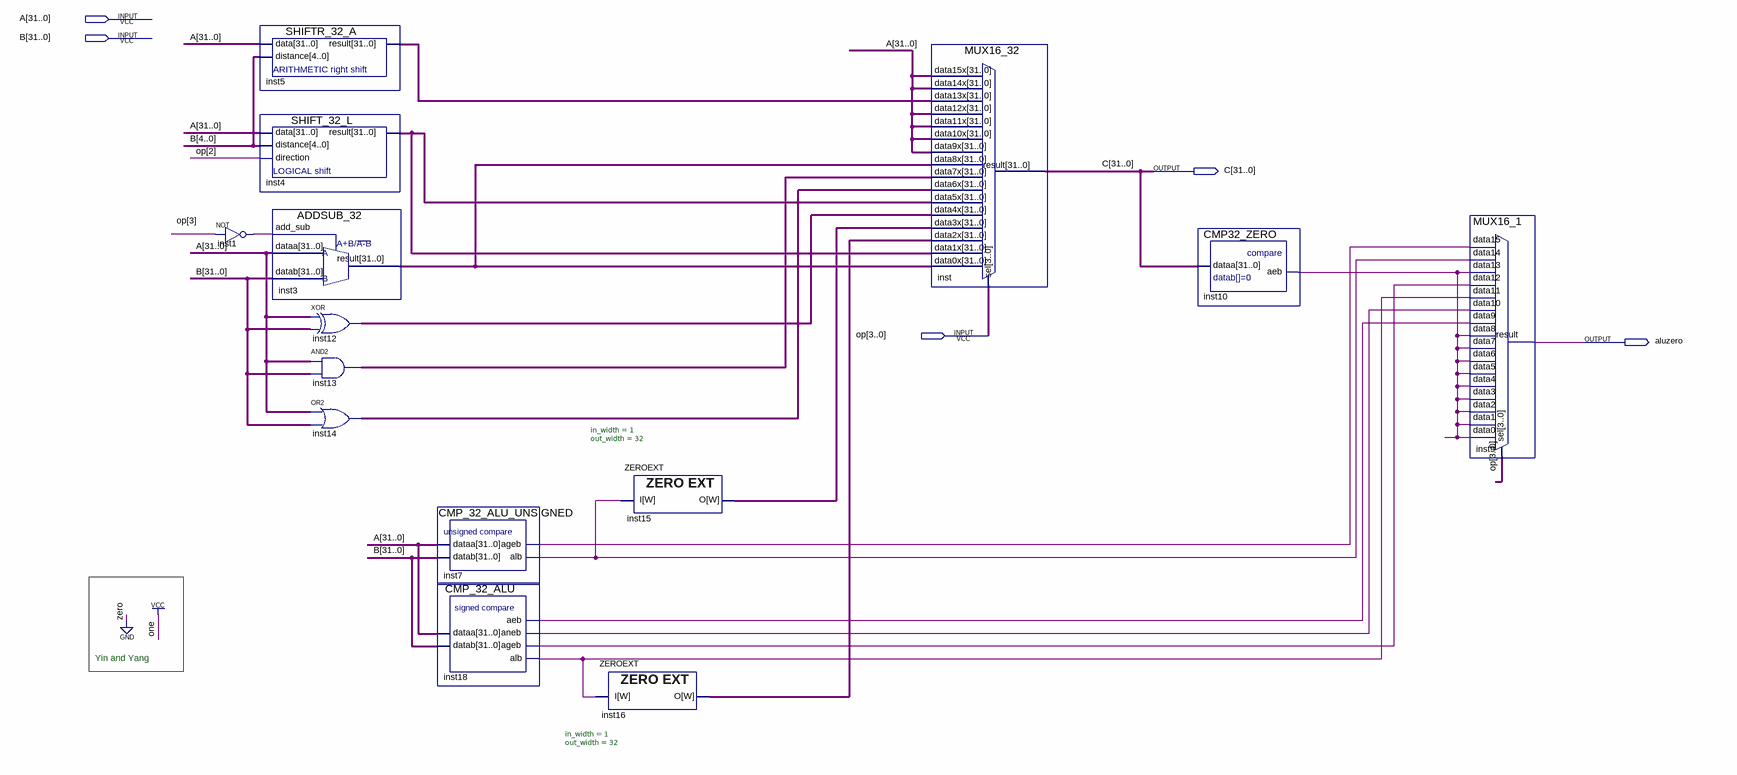
[diagram p0: schematic sheet]
// Quartus schematic ALU.bdf as structural Verilog: 14 symbols, 5 pins
module ALU (
  input  [31:0] A,
  input  [31:0] B,
  input  [3:0] op,
  output [31:0] C,
  output aluzero
);

  wire inst1_out, inst7_ageb, inst7_alb, inst10_aeb, inst18_aeb, inst18_ageb, inst18_alb, inst18_aneb;
  wire [31:0] inst3_result, inst4_result, inst5_result, inst12_out, inst13_out, inst14_out, inst15_o,
       inst16_o;

  not inst1 (inst1_out, op[3]);
  SHIFTR_32_A inst5 (.data(A), .distance(B[4:0]), .result(inst5_result));
  SHIFT_32_L inst4 (.data(A), .distance(B[4:0]), .direction(op[2]), .result(inst4_result));
  ADDSUB_32 inst3 (.add_sub(inst1_out), .dataa(A), .datab(B), .result(inst3_result));
  assign inst12_out = A ^ B;  // XOR inst12, 32 bits wide
  assign inst13_out = A & B;  // AND2 inst13, 32 bits wide
  assign inst14_out = A | B;  // OR2 inst14, 32 bits wide
  CMP_32_ALU_UNSIGNED inst7 (.dataa(A), .datab(B), .ageb(inst7_ageb), .alb(inst7_alb));
  CMP_32_ALU inst18 (.dataa(A), .datab(B), .aeb(inst18_aeb), .aneb(inst18_aneb), .ageb(inst18_ageb), .alb(inst18_alb));
  ZEROEXT #(.in_width(1), .out_width(32)) inst16 (.I(inst18_alb), .O(inst16_o));
  ZEROEXT #(.in_width(1), .out_width(32)) inst15 (.I(inst7_alb), .O(inst15_o));
  MUX16_32 inst (
    .data15x(A), .data14x(A), .data13x(inst5_result), .data12x(A), .data11x(A), .data10x(A), .data9x(A),
    .data8x(inst3_result), .data7x(inst13_out), .data6x(inst14_out), .data5x(inst4_result),
    .data4x(inst12_out), .data3x(inst15_o), .data2x(inst16_o), .data1x(inst4_result), .data0x(inst3_result),
    .sel(op), .result(C));
  CMP32_ZERO inst10 (.dataa(C), .aeb(inst10_aeb));
  MUX16_1 inst9 (
    .data15(inst7_ageb), .data14(inst7_alb), .data13(inst10_aeb), .data12(inst18_ageb), .data11(inst18_alb),
    .data10(inst18_aneb), .data9(inst18_aeb), .data8(inst10_aeb), .data7(inst10_aeb), .data6(inst10_aeb),
    .data5(inst10_aeb), .data4(inst10_aeb), .data3(inst10_aeb), .data2(inst10_aeb), .data1(inst10_aeb),
    .data0(inst10_aeb), .sel(op), .result(aluzero));

  // Notes on the sheet:
  //   Yin and Yang
endmodule
